# Altium schematic sheet Mcu.SchDoc: MCU: STM32F103C8T6 + reloj + reset + boot + SWD + UART + I2C + expansion
size A4; Author: Efrain Alvarado; CompanyName: Universidad de Cuenca - MCIE; DrawnBy: Efrain Alvarado; DocumentNumber: E08-M; Revision: 1.0; SheetNumber: 1; SheetTotal: 1
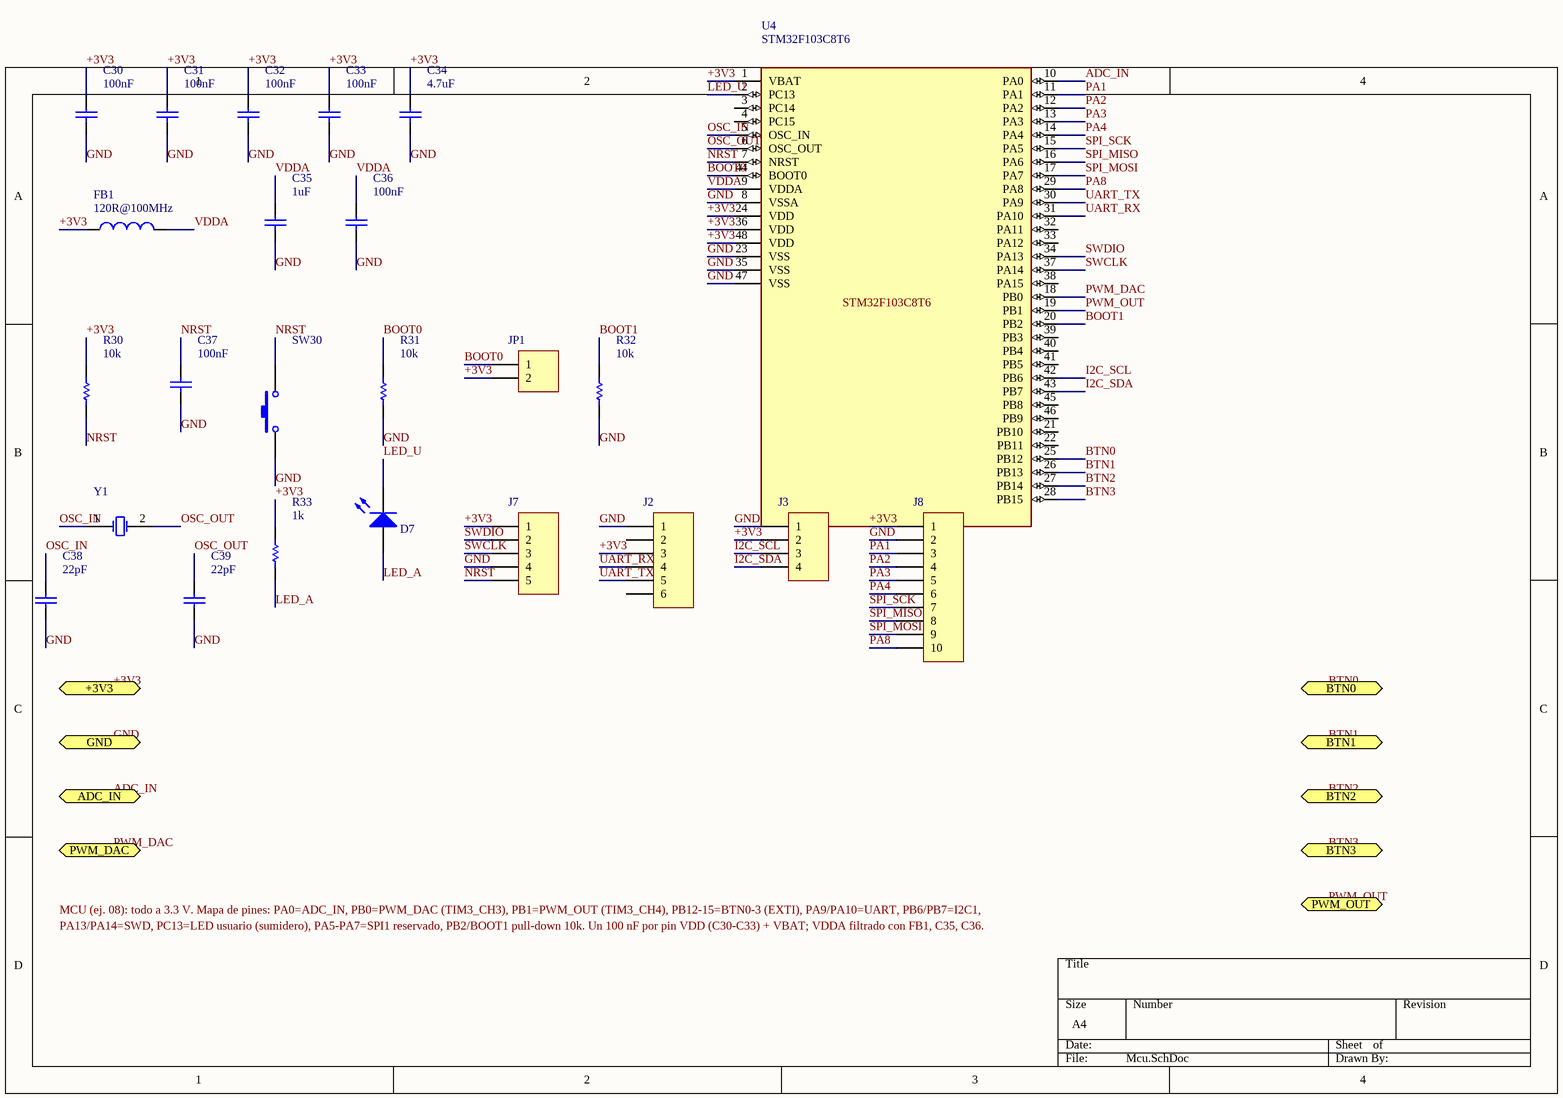
[diagram p0: Mcu.SchDoc]

## Parts
C30  value 100nF  [0603]  (hidden comment: Cap)
C31  value 100nF  [0603]  (hidden comment: Cap)
C32  value 100nF  [0603]  (hidden comment: Cap)
C33  value 100nF  [0603]  (hidden comment: Cap)
C34  value 4.7uF  [C0805]  (hidden comment: Cap)
C35  value 1uF  [0603]  (hidden comment: Cap)
C36  value 100nF  [0603]  (hidden comment: Cap)
C37  value 100nF  [0603]  (hidden comment: Cap)
C38  value 22pF  [0603]  (hidden comment: Cap)
C39  value 22pF  [0603]  (hidden comment: Cap)
D7  LED1  [LED-1]  (value not drawn)
FB1  value 120R@100MHz  [0603]  (hidden comment: Inductor)
J2  Header 6  [HDR1X6]  (value not drawn)
J3  Header 4  [HDR1X4]  (value not drawn)
J7  Header 5  [HDR1X5]  (value not drawn)
J8  Header 10  [HDR1X10]  (value not drawn)
JP1  Header 2  [HDR1X2]  (value not drawn)
R30  value 10k  [0603]  (hidden comment: Res1)
R31  value 10k  [0603]  (hidden comment: Res1)
R32  value 10k  [0603]  (hidden comment: Res1)
R33  value 1k  [0603]  (hidden comment: Res1)
SW30  SW-PB  [SPST-2]  (value not drawn)
U4  STM32F103C8T6  [LQFP48_7x7]
Y1  XTAL  [R38]  (value not drawn)

## Ports
+3V3, ADC_IN, BTN0, BTN1, BTN2, BTN3, GND, PWM_DAC, PWM_OUT

## Nets
+3V3: C30.2 C31.2 C32.2 C33.2 C34.2 FB1.1 J2.3 J3.2 J7.1 J8.1 JP1.2 R30.2 R33.2 U4.1(VBAT) U4.24(VDD) U4.36(VDD) U4.48(VDD) ; port +3V3
ADC_IN: U4.10(PA0) ; port ADC_IN
BOOT0: JP1.1 R31.2 U4.44(BOOT0)
BOOT1: R32.2 U4.20(PB2)
BTN0: U4.25(PB12) ; port BTN0
BTN1: U4.26(PB13) ; port BTN1
BTN2: U4.27(PB14) ; port BTN2
BTN3: U4.28(PB15) ; port BTN3
GND: C30.1 C31.1 C32.1 C33.1 C34.1 C35.1 C36.1 C37.1 C38.1 C39.1 J2.1 J3.1 J7.4 J8.2 R31.1 R32.1 SW30.1 U4.8(VSSA) U4.23(VSS) U4.35(VSS) U4.47(VSS) ; port GND
I2C_SCL: J3.3 U4.42(PB6)
I2C_SDA: J3.4 U4.43(PB7)
LED_A: D7.1(A) R33.1
LED_U: D7.2(K) U4.2(PC13)
NRST: C37.2 J7.5 R30.1 SW30.2 U4.7(NRST)
OSC_IN: C38.2 U4.5(OSC_IN) Y1.1(OSC1)
OSC_OUT: C39.2 U4.6(OSC_OUT) Y1.2(OSC2)
PA1: J8.3 U4.11(PA1)
PA2: J8.4 U4.12(PA2)
PA3: J8.5 U4.13(PA3)
PA4: J8.6 U4.14(PA4)
PA8: J8.10 U4.29(PA8)
PWM_DAC: U4.18(PB0) ; port PWM_DAC
PWM_OUT: U4.19(PB1) ; port PWM_OUT
SPI_MISO: J8.8 U4.16(PA6)
SPI_MOSI: J8.9 U4.17(PA7)
SPI_SCK: J8.7 U4.15(PA5)
SWCLK: J7.3 U4.37(PA14)
SWDIO: J7.2 U4.34(PA13)
UART_RX: J2.4 U4.31(PA10)
UART_TX: J2.5 U4.30(PA9)
VDDA: C35.2 C36.2 FB1.2 U4.9(VDDA)

Not connected (* = marked no-connect by the designer): J2 2 6; U4 3(PC14) 4(PC15) 21(PB10) 22(PB11) 32(PA11) 33(PA12) 38(PA15) 39(PB3) 40(PB4) 41(PB5) 45(PB8) 46(PB9)

## Notes on the sheet
- MCU (ej. 08): todo a 3.3 V. Mapa de pines: PA0=ADC_IN, PB0=PWM_DAC (TIM3_CH3), PB1=PWM_OUT (TIM3_CH4), PB12-15=BTN0-3 (EXTI), PA9/PA10=UART, PB6/PB7=I2C1,
- PA13/PA14=SWD, PC13=LED usuario (sumidero), PA5-PA7=SPI1 reservado, PB2/BOOT1 pull-down 10k. Un 100 nF por pin VDD (C30-C33) + VBAT; VDDA filtrado con FB1, C35, C36.

## Library data of the parts
C30-C33 C36 C37 = Cap: Capacitor 100nF; Manufacturer: KEMET; Manufacturer Part Number: C0603C100nF; Published: 8-Jun-2000; LatestRevisionDate: 17-Jul-2002; LatestRevisionNote: Re-released for DXP Platform.; PackageReference: RAD-0.3; Publisher: Altium Limited; PackageDescription: Radial Cap, Thru-Hole; 2 Leads; 0.3 in Pin Spacing
C34 = Cap: Capacitor 4.7uF; Manufacturer: KEMET; Manufacturer Part Number: C0805C4754.7uF; Published: 8-Jun-2000; LatestRevisionDate: 17-Jul-2002; LatestRevisionNote: Re-released for DXP Platform.; PackageReference: RAD-0.3; Publisher: Altium Limited; PackageDescription: Radial Cap, Thru-Hole; 2 Leads; 0.3 in Pin Spacing
C35 = Cap: Capacitor 1uF; Manufacturer: KEMET; Manufacturer Part Number: C0603C1051uF; Published: 8-Jun-2000; LatestRevisionDate: 17-Jul-2002; LatestRevisionNote: Re-released for DXP Platform.; PackageReference: RAD-0.3; Publisher: Altium Limited; PackageDescription: Radial Cap, Thru-Hole; 2 Leads; 0.3 in Pin Spacing
C38 C39 = Cap: Capacitor 22pF; Manufacturer: KEMET; Manufacturer Part Number: C0603C22022pF; Published: 8-Jun-2000; LatestRevisionDate: 17-Jul-2002; LatestRevisionNote: Re-released for DXP Platform.; PackageReference: RAD-0.3; Publisher: Altium Limited; PackageDescription: Radial Cap, Thru-Hole; 2 Leads; 0.3 in Pin Spacing
D7 = LED1: LED de usuario (PC13 sumidero); Manufacturer: Kingbright; Manufacturer Part Number: WP7113ID; Published: 8-Jun-2000; LatestRevisionDate: 08-Jul-2005; LatestRevisionNote: Mech Layer 1 removed.; PackageReference: LED-1; Publisher: Altium Limited; PackageDescription: LED; 2 Leads
FB1 = Inductor: Ferrite bead VDD -> VDDA; Manufacturer: Murata; Manufacturer Part Number: BLM18PG121SN1D; Code_IEC: 1005; Published: 8-Jun-2000; LatestRevisionDate: 29-May-2009; LatestRevisionNote: IPC-7351 Footprint Added.; PackageReference: 0402-A; Publisher: Altium Limited; PackageDescription: Chip Inductor; Code_JEITA: 0402
J2 = Header 6: UART FTDI: GND, -, 3V3, RX, TX, -; Manufacturer: Generic; Manufacturer Part Number: Pin header 1x6 FTDI; LatestRevisionDate: 17-Jul-2002; LatestRevisionNote: Re-released for DXP Platform.; Publisher: Altium Limited
J3 = Header 4: I2C: GND, 3V3, SCL, SDA; Manufacturer: Generic; Manufacturer Part Number: Pin header 1x4; LatestRevisionDate: 17-Jul-2002; LatestRevisionNote: Re-released for DXP Platform.; Publisher: Altium Limited
J7 = Header 5: SWD: 3V3, SWDIO, SWCLK, GND, NRST; Manufacturer: Generic; Manufacturer Part Number: Pin header 1x5; LatestRevisionDate: 17-Jul-2002; LatestRevisionNote: Re-released for DXP Platform.; Publisher: Altium Limited
J8 = Header 10: Expansion: 3V3, GND, PA1-PA4, SPI SCK/MISO/MOSI, PA8; Manufacturer: Generic; Manufacturer Part Number: Pin header 1x10; LatestRevisionDate: 17-Jul-2002; LatestRevisionNote: Re-released for DXP Platform.; Publisher: Altium Limited
JP1 = Header 2: Jumper BOOT0: cerrado = bootloader UART; Manufacturer: Generic; Manufacturer Part Number: Pin header 1x2; LatestRevisionDate: 17-Jul-2002; LatestRevisionNote: Re-released for DXP Platform.; Publisher: Altium Limited
R30-R32 = Res1: Resistor 10k 0603; Manufacturer: Yageo; Manufacturer Part Number: RC0603FR-0710K; Published: 8-Jun-2000; LatestRevisionDate: 17-Jul-2002; LatestRevisionNote: Re-released for DXP Platform.; PackageReference: AXIAL-0.3; Publisher: Altium Limited; PackageDescription: Axial Device, Thru-Hole; 2 Leads; 0.3 in Pin Spacing
R33 = Res1: Resistor 1k 0603; Manufacturer: Yageo; Manufacturer Part Number: RC0603FR-071K; Published: 8-Jun-2000; LatestRevisionDate: 17-Jul-2002; LatestRevisionNote: Re-released for DXP Platform.; PackageReference: AXIAL-0.3; Publisher: Altium Limited; PackageDescription: Axial Device, Thru-Hole; 2 Leads; 0.3 in Pin Spacing
SW30 = SW-PB: Reset manual; Manufacturer: Generic; Manufacturer Part Number: Tactile 6x6; Published: 24-Mar-1999; LatestRevisionDate: 17-Jul-2002; LatestRevisionNote: Re-released for DXP Platform.; PackageReference: SPST-2; Publisher: Altium Limited; PackageDescription: Switch; 2 Leads
U4 = STM32F103C8T6: STM32F103C8T6 ARM Cortex-M3 72 MHz LQFP48; Manufacturer: STMicroelectronics; Manufacturer Part Number: STM32F103C8T6
Y1 = XTAL: Cristal 8 MHz CL=20 pF; Manufacturer: Abracon; Manufacturer Part Number: ABL-8.000MHZ-B2; Published: 8-Jun-2000; LatestRevisionDate: 17-Jul-2002; LatestRevisionNote: Re-released for DXP Platform.; PackageReference: R38; Publisher: Altium Limited; PackageDescription: Crystal, Thru-Hole; 2 Leads; Body 3.1 x 8.2 mm (Dia.xH)